# Altium project 4_LED_7_SEGMENT.PrjPcb
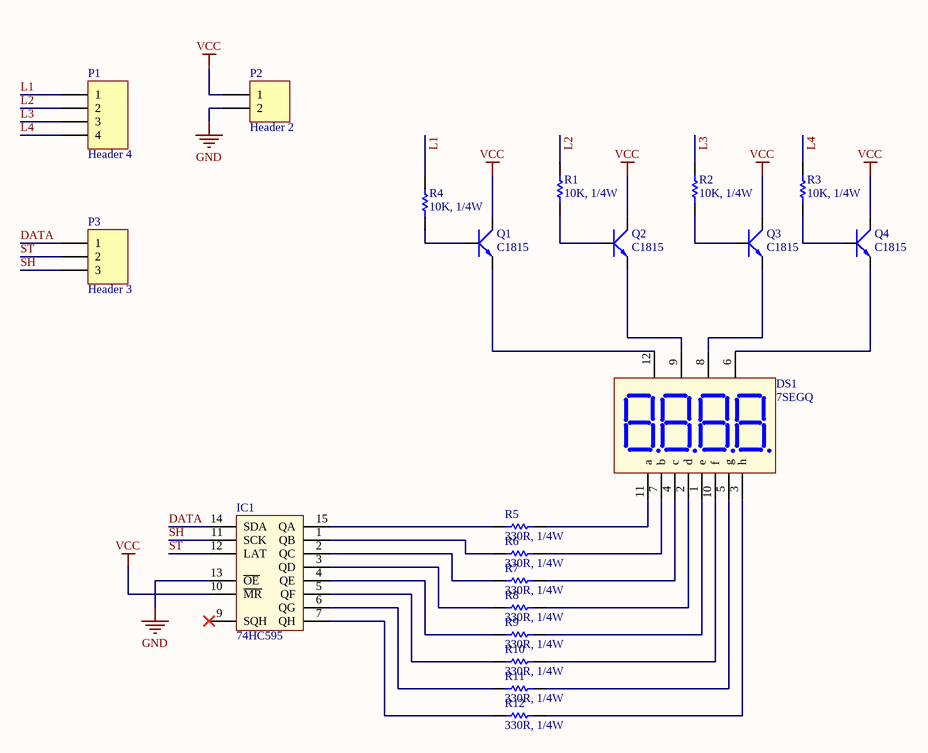
[diagram p0: Schematic.SchDoc]
1 sheet, 21 parts. Net scope: global (net labels, ports and power ports of the same name join across sheets).

## Sheet Schematic.SchDoc
size A

### Parts
DS1  7SEGQ  [7SEGQ]
IC1  74HC595  [DIP16/W0.3]
P1  Header 4  [HDR1X4]
P2  Header 2  [HDR1X2]
P3  Header 3  [HDR1X3]
Q1  C1815  [QTO-92]
Q2  C1815  [QTO-92]
Q3  C1815  [QTO-92]
Q4  C1815  [QTO-92]
R1  value 10K, 1/4W  [AXIAL-0.3]  (hidden comment: CF1/4W10KJ25)
R2  value 10K, 1/4W  [AXIAL-0.3]  (hidden comment: CF1/4W10KJ25)
R3  value 10K, 1/4W  [AXIAL-0.3]  (hidden comment: CF1/4W10KJ25)
R4  value 10K, 1/4W  [AXIAL-0.3]  (hidden comment: CF1/4W10KJ25)
R5  value 330R, 1/4W  [AXIAL-0.3]  (hidden comment: CF1/4W330RJ25)
R6  value 330R, 1/4W  [AXIAL-0.3]  (hidden comment: CF1/4W330RJ25)
R7  value 330R, 1/4W  [AXIAL-0.3]  (hidden comment: CF1/4W330RJ25)
R8  value 330R, 1/4W  [AXIAL-0.3]  (hidden comment: CF1/4W330RJ25)
R9  value 330R, 1/4W  [AXIAL-0.3]  (hidden comment: CF1/4W330RJ25)
R10  value 330R, 1/4W  [AXIAL-0.3]  (hidden comment: CF1/4W330RJ25)
R11  value 330R, 1/4W  [AXIAL-0.3]  (hidden comment: CF1/4W330RJ25)
R12  value 330R, 1/4W  [AXIAL-0.3]  (hidden comment: CF1/4W330RJ25)

### Nets
GND: IC1.8(GND) IC1.13(~{OE}) P2.2
VCC: IC1.10(~{MR}) IC1.16(VCC) P2.1 Q1.2(C) Q2.2(C) Q3.2(C) Q4.2(C)
DATA: IC1.14(SDA) P3.1
L1: P1.1 R4.2
L2: P1.2 R1.2
L3: P1.3 R2.2
L4: P1.4 R3.2
SH: IC1.11(SCK) P3.3
ST: IC1.12(LAT) P3.2
NetDS1_1: DS1.1(e) R9.2
NetDS1_2: DS1.2(d) R8.2
NetDS1_3: DS1.3(h) R12.2
NetDS1_4: DS1.4(c) R7.2
NetDS1_5: DS1.5(g) R11.2
NetDS1_6: DS1.6(V4) Q4.1(E)
NetDS1_7: DS1.7(b) R6.2
NetDS1_8: DS1.8(V3) Q3.1(E)
NetDS1_9: DS1.9(V2) Q2.1(E)
NetDS1_10: DS1.10(f) R10.2
NetDS1_11: DS1.11(a) R5.2
NetDS1_12: DS1.12(V1) Q1.1(E)
NetIC1_1: IC1.1(QB) R6.1
NetIC1_2: IC1.2(QC) R7.1
NetIC1_3: IC1.3(QD) R8.1
NetIC1_4: IC1.4(QE) R9.1
NetIC1_5: IC1.5(QF) R10.1
NetIC1_6: IC1.6(QG) R11.1
NetIC1_7: IC1.7(QH) R12.1
NetIC1_15: IC1.15(QA) R5.1
NetQ1_3: Q1.3(B) R4.1
NetQ2_3: Q2.3(B) R1.1
NetQ3_3: Q3.3(B) R2.1
NetQ4_3: Q4.3(B) R3.1

Not connected (* = marked no-connect by the designer): IC1 9(SQH)*

### Library data of the parts
DS1 = LED7Q: Four 7 Seg Dipslay; Value: LED 7Q SEG
IC1 = 74595: 8 Bit Serial input - Parallel Output; Value: 74HC595
P1 = Header 4: Header, 4-Pin; LatestRevisionDate: 17-Jul-2002; LatestRevisionNote: Re-released for DXP Platform.; Publisher: Altium Limited
P2 = Header 2: Header, 2-Pin; LatestRevisionDate: 17-Jul-2002; LatestRevisionNote: Re-released for DXP Platform.; Publisher: Altium Limited
P3 = Header 3: Header, 3-Pin; LatestRevisionDate: 17-Jul-2002; LatestRevisionNote: Re-released for DXP Platform.; Publisher: Altium Limited
Q1-Q4 = C1815: NPN 600mW, ECB; Value: C1815
R1-R4 = CF1/4W10KJ25: RES CF AXIAL-0.3 5% 1/4W 10K; Unit Price: 0.001; ComponentLink1Description: Datasheet; ComponentLink1URL: D:\Dropbox\Datasheets\Passive Components\Resistors\Carbon Film Resistor.pdf
R5-R12 = CF1/4W330RJ25: RES CF AXIAL-0.3 5% 1/4W 330R; Unit Price: 0.001; ComponentLink1Description: Datasheet; ComponentLink1URL: D:\Dropbox\Datasheets\Passive Components\Resistors\Carbon Film Resistor.pdf